# Altium project Annunciator.PrjPCB
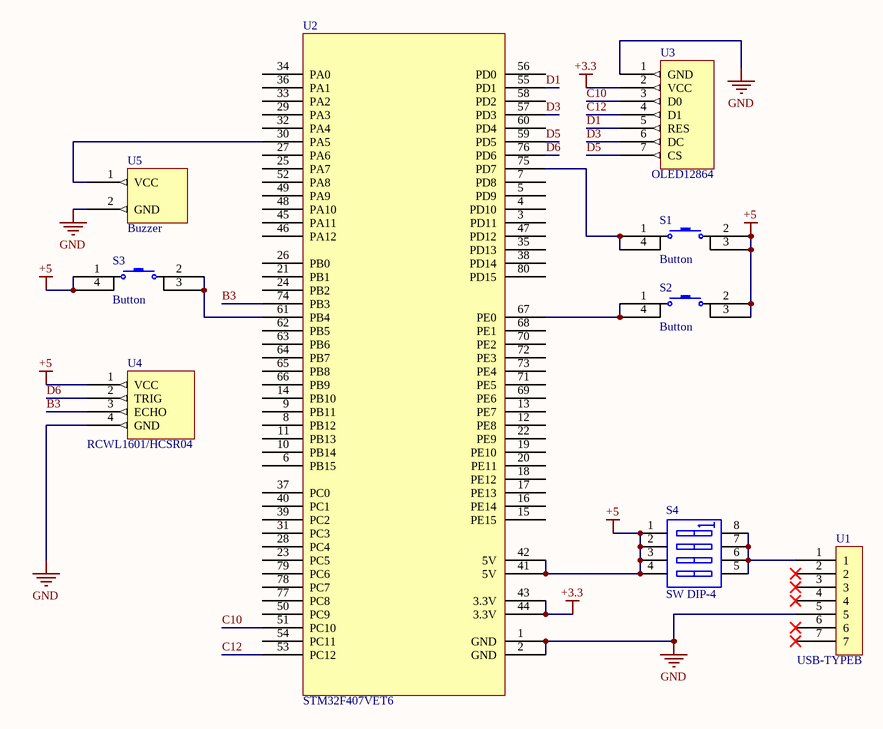
[diagram p0: Auunuciator.SchDoc]
1 sheet, 9 parts. Net scope: global (net labels, ports and power ports of the same name join across sheets).
Board file: Annunciator.PcbDoc

## Sheet Auunuciator.SchDoc
size A4

### Parts
S1  Button
S2  Button
S3  Button
S4  SW DIP-4  [DIP-8]
U1  USB-TYPEB  [microB USB Breakout]
U2  STM32F407VET6  [FK407M1]
U3  OLED12864  [HDR1X7]
U4  RCWL1601/HCSR04  [HDR1X4]
U5  Buzzer  [THDZ]

### Nets
+3.3: U2.43(3.3V) U2.44(3.3V) U3.2(VCC)
+5: S1.2 S1.3 S2.2 S2.3 S3.1 S3.4 S4.1(A1) S4.2(A2) S4.3(A3) S4.4(A4) U2.41(5V) U2.42(5V) U4.1(VCC)
GND: U1.5 U2.1(GND) U2.2(GND) U3.1(GND) U4.4(GND) U5.2(GND)
B3: U2.74(PB3) U4.3(ECHO)
C10: U2.51(PC10) U3.3(D0)
C12: U2.53(PC12) U3.4(D1)
D1: U2.55(PD1) U3.5(RES)
D3: U2.57(PD3) U3.6(DC)
D5: U2.59(PD5) U3.7(CS)
D6: U2.76(PD6) U4.2(TRIG)
NetS1_1: S1.1 S1.4 U2.75(PD7)
NetS2_1: S2.1 S2.4 U2.67(PE0)
NetS3_2: S3.2 S3.3 U2.61(PB4)
NetS4_5: S4.5(B4) S4.6(B3) S4.7(B2) S4.8(B1) U1.1
NetU2_30: U2.30(PA5) U5.1(VCC)

Not connected (* = marked no-connect by the designer): U1 2* 3* 4* 6* 7*; U2 3(PD11) 4(PD10) 5(PD9) 6(PB15) 7(PD8) 8(PB12) 9(PB11) 10(PB14) 11(PB13) 12(PE8) 13(PE7) 14(PB10) 15(PE15) 16(PE14) 17(PE13) 18(PE12) 19(PE10) 20(PE11) 21(PB1) 22(PE9) 23(PC5) 24(PB2) 25(PA7) 26(PB0) 27(PA6) 28(PC4) 29(PA3) 31(PC3) 32(PA4) 33(PA2) 34(PA0) 35(PD13) 36(PA1) 37(PC0) 38(PD14) 39(PC2) 40(PC1) 45(PA11) 46(PA12) 47(PD12) 48(PA10) 49(PA9) 50(PC9) 52(PA8) 54(PC11) 56(PD0) 58(PD2) 60(PD4) 62(PB5) 63(PB6) 64(PB7) 65(PB8) 66(PB9) 68(PE1) 69(PE6) 70(PE2) 71(PE5) 72(PE3) 73(PE4) 77(PC8) 78(PC7) 79(PC6) 80(PD15)

### Library data of the parts
S1-S3 = 4PinButton
S4 = SW DIP-4: DIP Switch, 4 Position, SPST; Published: 24-Mar-1999; LatestRevisionDate: 29-May-2009; LatestRevisionNote: IPC-7351 Footprint Added.; PackageVersion: Dec-2002; PackageReference: SO8; Publisher: Altium Limited; PackageDescription: 8-Pin Small Outline Integrated Circuit 1.27 mm Pitch; Code_JEDEC: MS-012-AA; Code_IPC: SOIC127P600-8
U1 = HEAD7A
U2 = FK407M1
U3 = OLED12864: OLED
U4 = RCWL1601/HCSR04: Ranging Module
U5 = Buzzer: Active; pin to pad: 1>VCC 2>GND